# Altium schematic sheet SWD_TagConnect.SchDoc: Tag-Connect SWD Port
size A4; DocumentNumber: 7; SheetNumber: 7; SheetTotal: 51
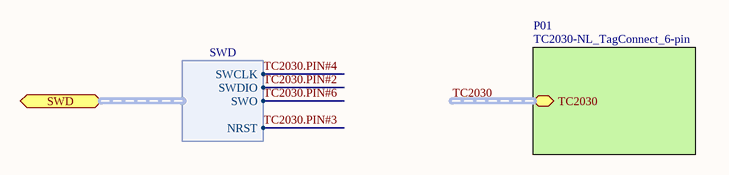
[diagram p0: SWD_TagConnect.SchDoc]

## Sub-sheets
P01 = TC2030-NL_TagConnect_6-pin: TC2030 (harness TC2030)

## Ports
SWD (harness SWD)

## Harnesses
SWD: SWDIO, SWCLK, NRST, SWO

## Nets
TC2030.PIN#2: port SWD.SWDIO
TC2030.PIN#3: port SWD.NRST
TC2030.PIN#4: port SWD.SWCLK
TC2030.PIN#6: port SWD.SWO

## Buses and harness runs
harness TC2030 = sheet P01/TC2030

## Notes on the sheet
- Title
- Size:
- Date:
- A4
- Number:
- Time:
- Revision:
- Sheet
- of
- File: